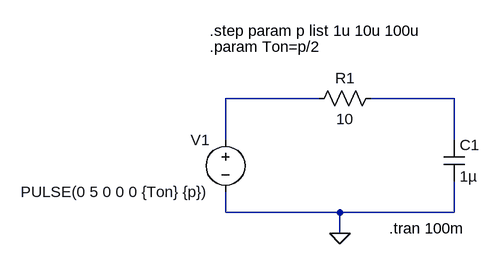
[diagram p0: schematic RC with .step and .param func..asc]
RC with .step and .param func..asc, the LTspice schematic file:
Version 4
SHEET 1 880 680
WIRE -384 -64 -528 -64
WIRE -176 -64 -304 -64
WIRE -528 0 -528 -64
WIRE -176 0 -176 -64
WIRE -528 112 -528 80
WIRE -352 112 -528 112
WIRE -176 112 -176 64
WIRE -176 112 -352 112
WIRE -352 144 -352 112
FLAG -352 144 0
SYMBOL res -288 -80 R90
WINDOW 0 0 56 VBottom 2
WINDOW 3 32 56 VTop 2
SYMATTR InstName R1
SYMATTR Value 10
SYMBOL cap -192 0 R0
SYMATTR InstName C1
SYMATTR Value 1µ
SYMBOL voltage -528 -16 M0
WINDOW 123 0 0 Left 0
WINDOW 39 0 0 Left 0
SYMATTR InstName V1
SYMATTR Value PULSE(0 5 0 0 0 {Ton} {p})
TEXT -552 -168 Left 2 !.step param p list 1u 10u 100u
TEXT -552 -144 Left 2 !.param Ton=p/2
TEXT -276 136 Left 2 !.tran 100m

The netlist it stands for:
* RC with .step and .param func..asc
R1 N002 N001 10
C1 N002 0 1µ
V1 N001 0 PULSE(0 5 0 0 0 {Ton} {p})
.step param p list 1u 10u 100u
.param Ton=p/2
.tran 100m
.backanno
.end